# EasyEDA Pro project RAM.eprj, schematic Schematic1
Board Name: Board1; Create Date: 2025-08-25; Page Name: P1; Project Name: RAM; Schematic Name: Schematic1; Update Date: 2025-08-26; Company: EasyEDA.com; Page Size: A4; Version: V1.0
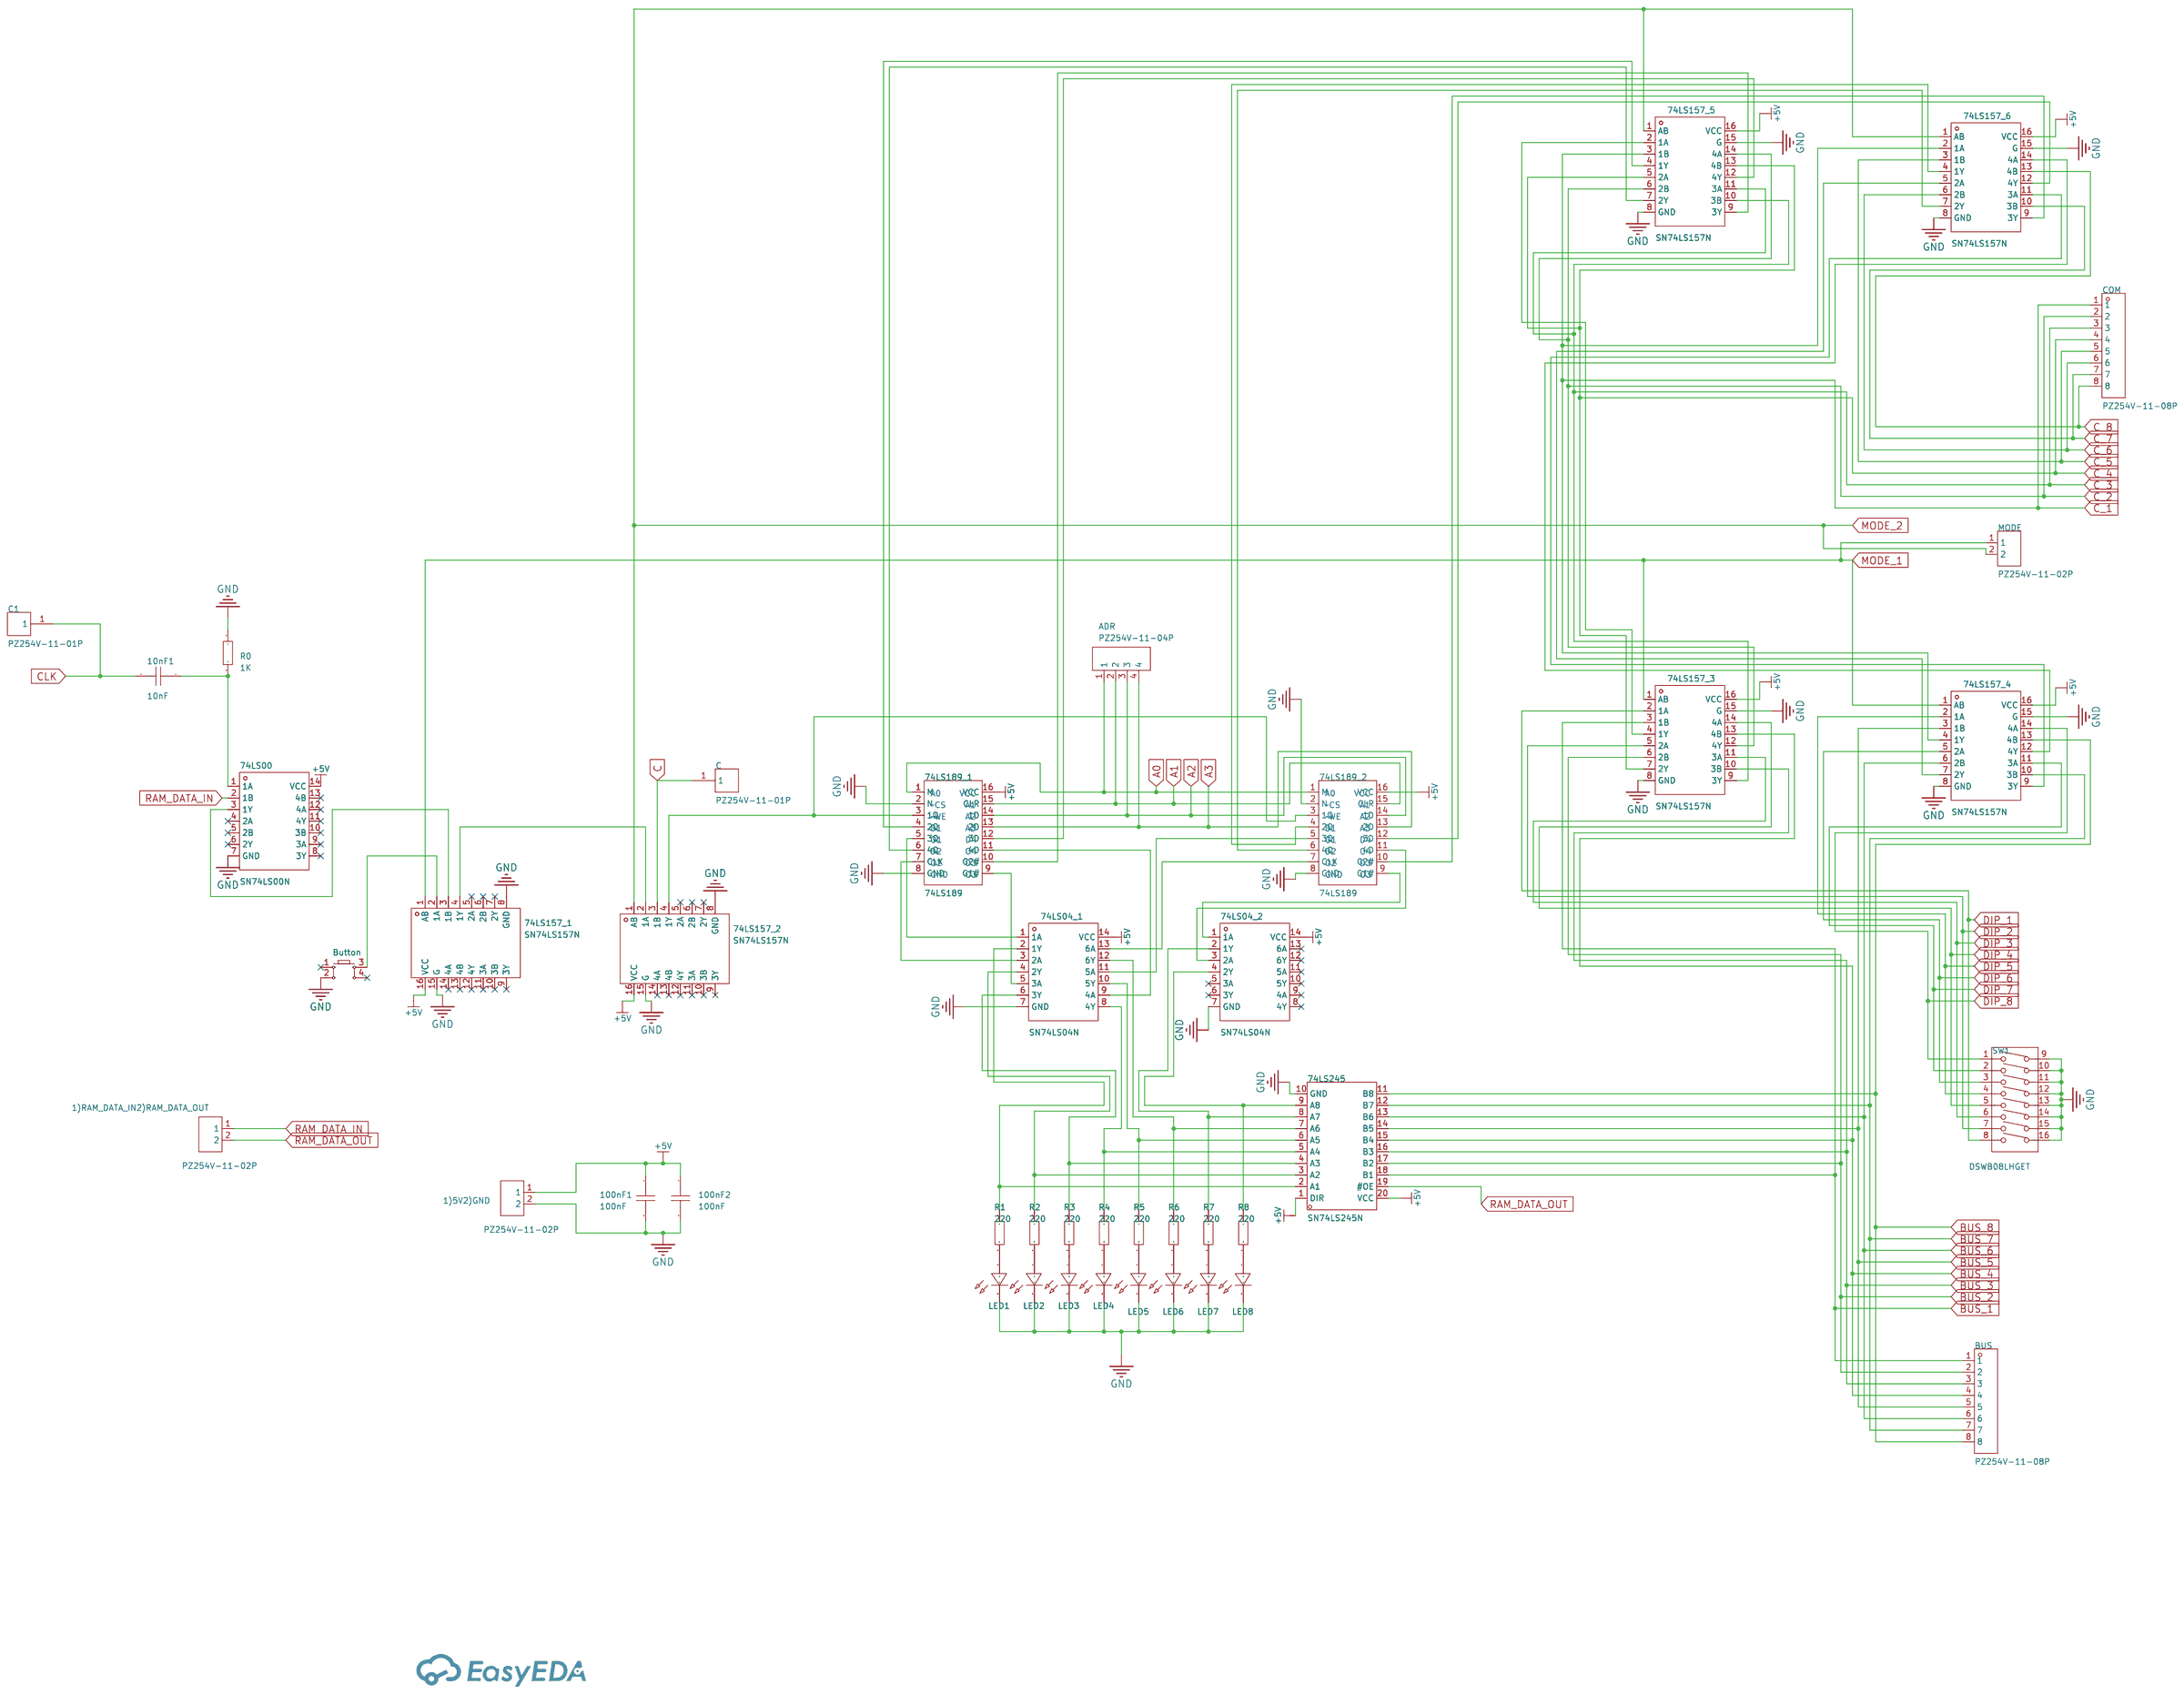
[diagram p0: schematic sheet]

## Parts
1)5V2)GND  PZ254V-11-02P  [HDR-TH_2P-P2.54-V-M]
1)RAM_DATA_IN2)RAM_DATA_OUT  PZ254V-11-02P  [HDR-TH_2P-P2.54-V-M]
10nF1  10nF  [CAP-TH_L8.5-W5.0-P5.00-D1.2]
74LS00  SN74LS00N  [PDIP-14_L19.7-W6.6-P2.54-LS8.3-BL]
74LS04_1  SN74LS04N  [PDIP-14_L19.7-W6.6-P2.54-LS8.3-BL]
74LS04_2  SN74LS04N  [PDIP-14_L19.7-W6.6-P2.54-LS8.3-BL]
74LS157_1  SN74LS157N  [DIP-16_16P-L20.2-W6.6-P2.54-LS7.6-BL]
74LS157_2  SN74LS157N  [DIP-16_16P-L20.2-W6.6-P2.54-LS7.6-BL]
74LS157_3  SN74LS157N  [DIP-16_16P-L20.2-W6.6-P2.54-LS7.6-BL]
74LS157_4  SN74LS157N  [DIP-16_16P-L20.2-W6.6-P2.54-LS7.6-BL]
74LS157_5  SN74LS157N  [DIP-16_16P-L20.2-W6.6-P2.54-LS7.6-BL]
74LS157_6  SN74LS157N  [DIP-16_16P-L20.2-W6.6-P2.54-LS7.6-BL]
74LS189_1  74LS189  [PDIP-16_L19.3-W6.4-P2.54-LS7.94-BL]
74LS189_2  74LS189  [PDIP-16_L19.3-W6.4-P2.54-LS7.94-BL]
74LS245  SN74LS245N  [DIP-20_L25.5-W10.0-P2.54-LS7.6-BL]
100nF1  100nF  [CAP-TH_L8.5-W5.0-P5.00-D1.2]
100nF2  100nF  [CAP-TH_L8.5-W5.0-P5.00-D1.2]
ADR  PZ254V-11-04P  [HDR-TH_4P-P2.54-V-M]
BUS  PZ254V-11-08P  [HDR-TH_8P-P2.54-V-M]
Button  -  [SW-TH_4P-L6.0-W6.0-P4.50-LS6.5]
C  PZ254V-11-01P  [HDR-TH_1P-P2.54-V-M]
C1  PZ254V-11-01P  [HDR-TH_1P-P2.54-V-M]
COM  PZ254V-11-08P  [HDR-TH_8P-P2.54-V-M]
LED1  -  [LED-TH_BD5.8-P2.54-FD]
LED2  -  [LED-TH_BD5.8-P2.54-FD]
LED3  -  [LED-TH_BD5.8-P2.54-FD]
LED4  -  [LED-TH_BD5.8-P2.54-FD]
LED5  -  [LED-TH_BD5.8-P2.54-FD]
LED6  -  [LED-TH_BD5.8-P2.54-FD]
LED7  -  [LED-TH_BD5.8-P2.54-FD]
LED8  -  [LED-TH_BD5.8-P2.54-FD]
MODE  PZ254V-11-02P  [HDR-TH_2P-P2.54-V-M]
R0  1K  [R_AXIAL-0.4]
R1  220  [R_AXIAL-0.4]
R2  220  [R_AXIAL-0.4]
R3  220  [R_AXIAL-0.4]
R4  220  [R_AXIAL-0.4]
R5  220  [R_AXIAL-0.4]
R6  220  [R_AXIAL-0.4]
R7  220  [R_AXIAL-0.4]
R8  220  [R_AXIAL-0.4]
SW1  DSWB08LHGET  [SW-TH_DSWB08LHGET]

## Library data of the parts
1)5V2)GND 1)RAM_DATA_IN2)RAM_DATA_OUT MODE = PZ254V-11-02P: Pin Structure:1x2P Pitch:2.54mm Row Spacing:- Circluar Pins/Square Pins:Policy Mounting Type:Straight Number of Rows:Single Row Number of Pins:2P Current Rating:- Voltage Rating (Max):- Length of Mating Pin:6mm Insulation Height:2.5mm Length of End Connec; LCSC Part Name: 1x2P 间距:2.54mm 方针 直插; Supplier Part: C492401; Manufacturer: XFCN(兴飞); Supplier Footprint: 插件,P=2.54mm; JLCPCB Part Class: Extended Part; Datasheet: https://atta.szlcsc.com/upload/public/pdf/source/20200309/C492401_A812433581A9B211A7FFA413ADDFF0E5.pdf; Supplier: LCSC; Pin Structure: 1x2P; Pitch: 2.54mm; Circluar Pins/Square Pins: Policy; Mounting Type: Straight; Number of Rows: Single Row; Number of Pins: 2P; Length of Mating Pin: 6mm; Insulation Height: 2.5mm; Length of End Connection Pin: 3mm; Contact Material: Brass; Operating Temperature: -40℃~+105℃; Color: Black
10nF1 100nF1 100nF2 = CT4-0805B104K500F3: Capacitance:100nF Tolerance:±10% Tolerance:±10% Voltage Rated: Temperature Coefficient:; LCSC Part Name: 100nF ±10% 50V C3型（直脚）; Supplier Part: C84772; Manufacturer: FH(风华); Supplier Footprint: 插件,P=5.08mm; JLCPCB Part Class: Extended Part; Datasheet: https://atta.szlcsc.com/upload/public/pdf/source/20190402/C385200_059806A6312B28FF1421A2413EB641E1.pdf; Supplier: LCSC; Tolerance: ±10%
74LS00 = SN74LS00N: Logic Type:NAND Gate Number of Channels:4 Voltage - Supply:4.75V~5.25V Voltage - Supply:4.75V~5.25V Current - Output Low(IOL):8mA Current - Output High(IOH):400uA Input Logic Level - High:2V Input Logic Level - High:2V Input Logic Level - Low:800mV Input; Supplier Part: C181629; Manufacturer: TI(德州仪器); Supplier Footprint: PDIP-14; JLCPCB Part Class: Extended Part; Datasheet: https://www.ti.com/cn/lit/gpn/sn74ls00; Supplier: LCSC; Logic Type: NAND Gate; Number of Channels: 4; Voltage - Supply: 4.75V~5.25V; Current - Output Low(IOL): 8mA; Current - Output High(IOH): 400uA; Input Logic Level - High: 2V; Input Logic Level - Low: 800mV; Series: 74LSSeries; Propagation Delay: 15ns@5V,15pF; Operating Temperature: 0℃~+70℃
74LS04_1 74LS04_2 = SN74LS04N: Voltage - Supply:4.75V~5.25V Voltage - Supply:4.75V~5.25V Number of Circuits:6 Number of Inputs:1 Current - Output Low(IOL):8mA Current - Output High(IOH):400uA Input Logic Level - High:2V Input Logic Level - High:2V Input Logic Level -Low:800mV Input Log; Supplier Part: C183657; Manufacturer: TI(德州仪器); Supplier Footprint: PDIP-14; JLCPCB Part Class: Extended Part; Datasheet: https://www.ti.com/cn/lit/gpn/sn74ls04; Supplier: LCSC; Voltage - Supply: 4.75V~5.25V; Number of Circuits: 6; Number of Inputs: 1; Current - Output Low(IOL): 8mA; Current - Output High(IOH): 400uA; Input Logic Level - High: 2V; Input Logic Level -Low: 800mV; Max Propagation Delay: 15ns@5V,15pF; Series: 74LSSeries; Operating Temperature: 0℃~+70℃
74LS157_1-74LS157_6 = SN74LS157N: Type:Multiplexers Voltage Supply Source:Single supply Supply Voltage:4.75V~5.25V Supply Voltage:4.75V~5.25V Sink Current:8mA Source Current:400uA Operating temperature:0℃~+70℃ Operating temperature:0℃~+70℃; Supplier Part: C139317; Manufacturer: TI(德州仪器); Supplier Footprint: DIP-16; JLCPCB Part Class: Extended Part; Datasheet: https://www.ti.com/cn/lit/gpn/sn74ls157; Supplier: LCSC; Type: Multiplexers; Voltage Supply Source: Single supply; Supply Voltage: 4.75V~5.25V; Sink Current: 8mA; Source Current: 400uA; Operating temperature: 0℃~+70℃
74LS189_1 74LS189_2 = SN74LS173AN: Type:D-Type Trigger Type:Rising Edge Voltage - Supply:4.75V~5.25V Voltage - Supply:4.75V~5.25V Clock Frequency:50MHz Function:Reset Number of Elements:1 Number of Bits per Element:4 Output Type:- Propagation Delay:30ns@5V,45pF Series:74LS Series Current -; Supplier Part: C1550125; Manufacturer: TI(德州仪器); Supplier Footprint: PDIP-16; JLCPCB Part Class: Extended Part; Datasheet: https://www.ti.com/cn/lit/gpn/sn74ls173a; Supplier: LCSC; Type: D-Type; Trigger Type: Rising Edge; Voltage - Supply: 4.75V~5.25V; Clock Frequency: 50MHz; Function: Reset; Number of Elements: 1; Number of Bits per Element: 4; Propagation Delay: 30ns@5V,45pF; Series: 74LS Series; Current - Output Low(IOL): 24mA; Current - Output High(IOH): 2.6mA; Quiescent Current: 24mA; Operating Temperature: 0℃~+70℃
74LS245 = SN74LS245N: output type:Tri-State Voltage - Supply:4.75V~5.25V Voltage - Supply:4.75V~5.25V Number of Elements:1 Number of Bits per Element:8 Current - Output Low(IOL):24mA Current - Output High(IOH):15mA Logic Family:74LS Operating Temperature:0℃~+70℃ Operating Temp; Supplier Part: C352966; Manufacturer: TI(德州仪器); Supplier Footprint: DIP-20; JLCPCB Part Class: Extended Part; Datasheet: https://www.ti.com/cn/lit/gpn/sn74ls245; Supplier: LCSC; output type: Tri-State; Voltage - Supply: 4.75V~5.25V; Number of Elements: 1; Number of Bits per Element: 8; Current - Output Low(IOL): 24mA; Current - Output High(IOH): 15mA; Logic Family: 74LS; Operating Temperature: 0℃~+70℃
ADR = PZ254V-11-04P_C492403: LCSC Part Name: 1x4P 间距:2.54mm 方针 直插; Supplier Part: C492403; Manufacturer: XFCN(兴飞); Supplier Footprint: 插件,P=2.54mm; JLCPCB Part Class: Extended Part; Datasheet: https://atta.szlcsc.com/upload/public/pdf/source/20200309/C492403_F9F19131791D08044AD4F84F8E751A34.pdf; Supplier: LCSC; Pin Structure: 1x4P; Pitch: 2.54mm; Circluar Pins/Square Pins: Policy; Mounting Type: Straight; Number of Rows: Single Row; Number of Pins: 4P; Length of Mating Pin: 6mm; Insulation Height: 2.5mm; Length of End Connection Pin: 3mm; Contact Material: Brass; Operating Temperature: -40℃~+105℃; Color: Black
BUS COM = PZ254V-11-08P: LCSC Part Name: 1x8P 间距:2.54mm 方针 直插; Supplier Part: C492407; Manufacturer: XFCN(兴飞); Supplier Footprint: 插件,P=2.54mm; JLCPCB Part Class: Extended Part; Datasheet: https://item.szlcsc.com/datasheet/PZ254V-11-08P/502963.html; Supplier: LCSC; Pin Structure: 1x8P; Pitch: 2.54mm; Circluar Pins/Square Pins: Pin Header; Mounting Type: Through Hole; Number of Rows: 1; Number of Pins: 8P; Length of Mating Pin: 6mm; Insulation Height: 2.5mm; Length of End Connection Pin: 3mm; Contact Material: Brass; Operating Temperature: -40℃~+105℃; Color: Black
Button = Key_TH_6x6x6: Supplier Footprint: Through
C C1 = PZ254V-11-01P: LCSC Part Name: 1x1P 间距:2.54mm 方针 直插; Supplier Part: C492400; Manufacturer: XFCN(兴飞); Supplier Footprint: 插件,P=2.54mm; JLCPCB Part Class: Extended Part; Datasheet: https://item.szlcsc.com/datasheet/PZ254V-11-01P/502956.html; Supplier: LCSC; Pin Structure: 1x1P; Pitch: 2.54mm; Circluar Pins/Square Pins: Pin Header; Mounting Type: Through Hole; Number of Rows: 1; Number of Pins: 1P; Length of Mating Pin: 6mm; Insulation Height: 2.5mm; Length of End Connection Pin: 3mm; Contact Material: Brass; Operating Temperature: -40℃~+105℃; Color: Black
LED1-LED8 = LED_TH-R_5mm: Supplier Footprint: Through
R0-R8 = Res_AXIAL-1/4W: Supplier Footprint: Through
SW1 = DSWB08LHGET: LCSC Part Name: 间距2.54mm 平拨,凸起式  8位拨码开关; Supplier Part: C99413; Manufacturer: YE; Supplier Footprint: 插件; JLCPCB Part Class: Extended Part; Datasheet: https://atta.szlcsc.com/upload/public/pdf/source/20170330/1490854214069.pdf; Supplier: LCSC; Type: 平拨,凸起式; Circuit: SPST; Number of Positions: 8Bit; Lead Pitch: 2.54mm; Color: Red

## Nets
+5V: 1)5V2)GND.1 74LS00.14(VCC) 74LS04_1.14(VCC) 74LS04_2.14(VCC) 74LS157_1.16(VCC) 74LS157_2.16(VCC) 74LS157_3.16(VCC) 74LS157_4.16(VCC) 74LS157_5.16(VCC) 74LS157_6.16(VCC) 74LS189_1.16(VCC) 74LS189_2.16(VCC) 74LS245.1(DIR) 74LS245.20(VCC) 100nF1.1 100nF2.1
GND: 1)5V2)GND.2 74LS00.7(GND) 74LS04_1.7(GND) 74LS04_2.7(GND) 74LS157_1.8(GND) 74LS157_1.15(G) 74LS157_2.8(GND) 74LS157_2.15(G) 74LS157_3.8(GND) 74LS157_3.15(G) 74LS157_4.8(GND) 74LS157_4.15(G) 74LS157_5.8(GND) 74LS157_5.15(G) 74LS157_6.8(GND) 74LS157_6.15(G) 74LS189_1.2(N) 74LS189_1.8(GND) 74LS189_2.2(N) 74LS189_2.8(GND) 74LS245.10(GND) 100nF1.2 100nF2.2 Button.2 LED1.2(A) LED2.2(A) LED3.2(A) LED4.2(A) LED5.2(A) LED6.2(A) LED7.2(A) LED8.2(A) R0.1 SW1.9 SW1.10 SW1.11 SW1.12 SW1.13 SW1.14 SW1.15 SW1.16
A0: 74LS189_1.1(M) 74LS189_2.1(M) ADR.1
A1: 74LS189_1.15(CLR) 74LS189_2.15(CLR) ADR.2
A2: 74LS189_1.14(1D) 74LS189_2.14(1D) ADR.3
A3: 74LS189_1.13(2D) 74LS189_2.13(2D) ADR.4
BUS_1: 74LS157_3.3(1B) 74LS245.18(B1) BUS.1
BUS_2: 74LS157_3.6(2B) 74LS245.17(B2) BUS.2
BUS_3: 74LS157_3.10(3B) 74LS245.16(B3) BUS.3
BUS_4: 74LS157_3.13(4B) 74LS245.15(B4) BUS.4
BUS_5: 74LS157_4.3(1B) 74LS245.14(B5) BUS.5
BUS_6: 74LS157_4.6(2B) 74LS245.13(B6) BUS.6
BUS_7: 74LS157_4.10(3B) 74LS245.12(B7) BUS.7
BUS_8: 74LS157_4.13(4B) 74LS245.11(B8) BUS.8
C: 74LS157_2.3(1B) C.1
C_1: 74LS157_4.4(1Y) 74LS157_5.3(1B) 74LS157_6.2(1A) COM.1
C_2: 74LS157_3.12(4Y) 74LS157_5.6(2B) 74LS157_5.14(4A) COM.2
C_3: 74LS157_3.9(3Y) 74LS157_5.10(3B) 74LS157_5.11(3A) COM.3
C_4: 74LS157_3.7(2Y) 74LS157_5.5(2A) 74LS157_5.13(4B) COM.4
C_5: 74LS157_6.3(1B) COM.5
C_6: 74LS157_6.6(2B) COM.6
C_7: 74LS157_6.10(3B) COM.7
C_8: 74LS157_6.13(4B) COM.8
CLK: 10nF1.2 C1.1
DIP_1: 74LS157_3.2(1A) SW1.8
DIP_2: 74LS157_3.5(2A) SW1.7
DIP_3: 74LS157_3.11(3A) SW1.6
DIP_4: 74LS157_3.14(4A) SW1.5
DIP_5: 74LS157_4.2(1A) SW1.4
DIP_6: 74LS157_4.5(2A) SW1.3
DIP_7: 74LS157_4.11(3A) SW1.2
DIP_8: 74LS157_4.14(4A) SW1.1
MODE_1: 74LS157_1.1(AB) 74LS157_3.1(AB) 74LS157_4.1(AB) MODE.1
MODE_2: 74LS157_2.1(AB) 74LS157_5.1(AB) 74LS157_6.1(AB) MODE.2
RAM_DATA_IN: 1)RAM_DATA_IN2)RAM_DATA_OUT.1 74LS00.2(1B)
RAM_DATA_OUT: 1)RAM_DATA_IN2)RAM_DATA_OUT.2 74LS245.19(#OE)
$1N1972: 74LS04_1.1(1A) 74LS189_1.5(3Q)
$1N1973: 74LS04_1.3(2A) 74LS189_1.7(CLK)
$1N1974: 74LS04_1.5(3A) 74LS189_1.9(G1#)
$1N1975: 74LS04_1.9(4A) 74LS189_1.11(4D)
$1N1976: 74LS04_1.11(5A) 74LS189_2.5(3Q)
$1N1977: 74LS04_1.13(6A) 74LS189_2.7(CLK)
$1N1978: 74LS04_2.1(1A) 74LS189_2.9(G1#)
$1N1979: 74LS04_2.3(2A) 74LS189_2.11(4D)
$1N1980: 74LS04_1.2(1Y) 74LS245.2(A1) R1.1
$1N1981: 74LS04_1.4(2Y) 74LS245.3(A2) R2.1
$1N1982: 74LS04_1.6(3Y) 74LS245.4(A3) R3.1
$1N1983: 74LS04_1.8(4Y) 74LS245.5(A4) R4.1
$1N1984: 74LS04_1.10(5Y) 74LS245.6(A5) R5.1
$1N1985: 74LS04_1.12(6Y) 74LS245.7(A6) R6.1
$1N1986: 74LS04_2.2(1Y) 74LS245.8(A7) R7.1
$1N1987: 74LS04_2.4(2Y) 74LS245.9(A8) R8.1
$1N1989: LED1.1(C) R1.2
$1N1990: LED8.1(C) R8.2
$1N1991: LED7.1(C) R7.2
$1N1992: LED6.1(C) R6.2
$1N1993: LED5.1(C) R5.2
$1N1994: LED4.1(C) R4.2
$1N1995: LED3.1(C) R3.2
$1N1996: LED2.1(C) R2.2
$1N2010: 74LS157_2.4(1Y) 74LS189_1.3(1Q) 74LS189_2.3(1Q)
$1N2047: 74LS157_1.2(1A) Button.3
$1N2048: 74LS00.3(1Y) 74LS157_1.3(1B)
$1N3924: 74LS157_1.4(1Y) 74LS157_2.2(1A)
$1N5081: 74LS157_5.4(1Y) 74LS189_1.4(2Q)
$1N5090: 74LS157_3.4(1Y) 74LS157_5.2(1A)
$1N5094: 74LS157_5.7(2Y) 74LS189_1.6(4Q)
$1N5107: 74LS157_5.9(3Y) 74LS189_1.10(G2#)
$1N5122: 74LS157_5.12(4Y) 74LS189_1.12(3D)
$1N5139: 74LS157_6.4(1Y) 74LS189_2.4(2Q)
$1N5152: 74LS157_6.7(2Y) 74LS189_2.6(4Q)
$1N5161: 74LS157_4.7(2Y) 74LS157_6.5(2A)
$1N5165: 74LS157_6.9(3Y) 74LS189_2.10(G2#)
$1N5176: 74LS157_4.9(3Y) 74LS157_6.11(3A)
$1N5180: 74LS157_6.12(4Y) 74LS189_2.12(3D)
$1N5191: 74LS157_4.12(4Y) 74LS157_6.14(4A)
Net-(10nF1-1): 10nF1.1 74LS00.1(1A) R0.2

Not connected (* = marked no-connect by the designer): 74LS00 4(2A)* 5(2B)* 6(2Y)* 8(3Y)* 9(3A)* 10(3B)* 11(4Y)* 12(4A)* 13(4B)*; 74LS04_2 5(3A)* 6(3Y)* 8(4Y)* 9(4A)* 10(5Y)* 11(5A)* 12(6Y)* 13(6A)*; 74LS157_1 5(2A)* 6(2B)* 7(2Y)* 9(3Y)* 10(3B)* 11(3A)* 12(4Y)* 13(4B)* 14(4A)*; 74LS157_2 5(2A)* 6(2B)* 7(2Y)* 9(3Y)* 10(3B)* 11(3A)* 12(4Y)* 13(4B)* 14(4A)*; Button 1* 4*

## Notes on the sheet
- A0
- ~CS
- VCC
- A1
- A0
- ~CS
- VCC
- A1
- ~WE
- A2
- ~WE
- A2
- D1
- A3
- D1
- A3
- O1
- D4
- O1
- D4
- D2
- O4
- D2
- O4
- O2
- D3
- O2
- D3
- GND
- O3
- GND
- O3
